# Altium schematic sheet Preamp_protection.SchDoc
size A4
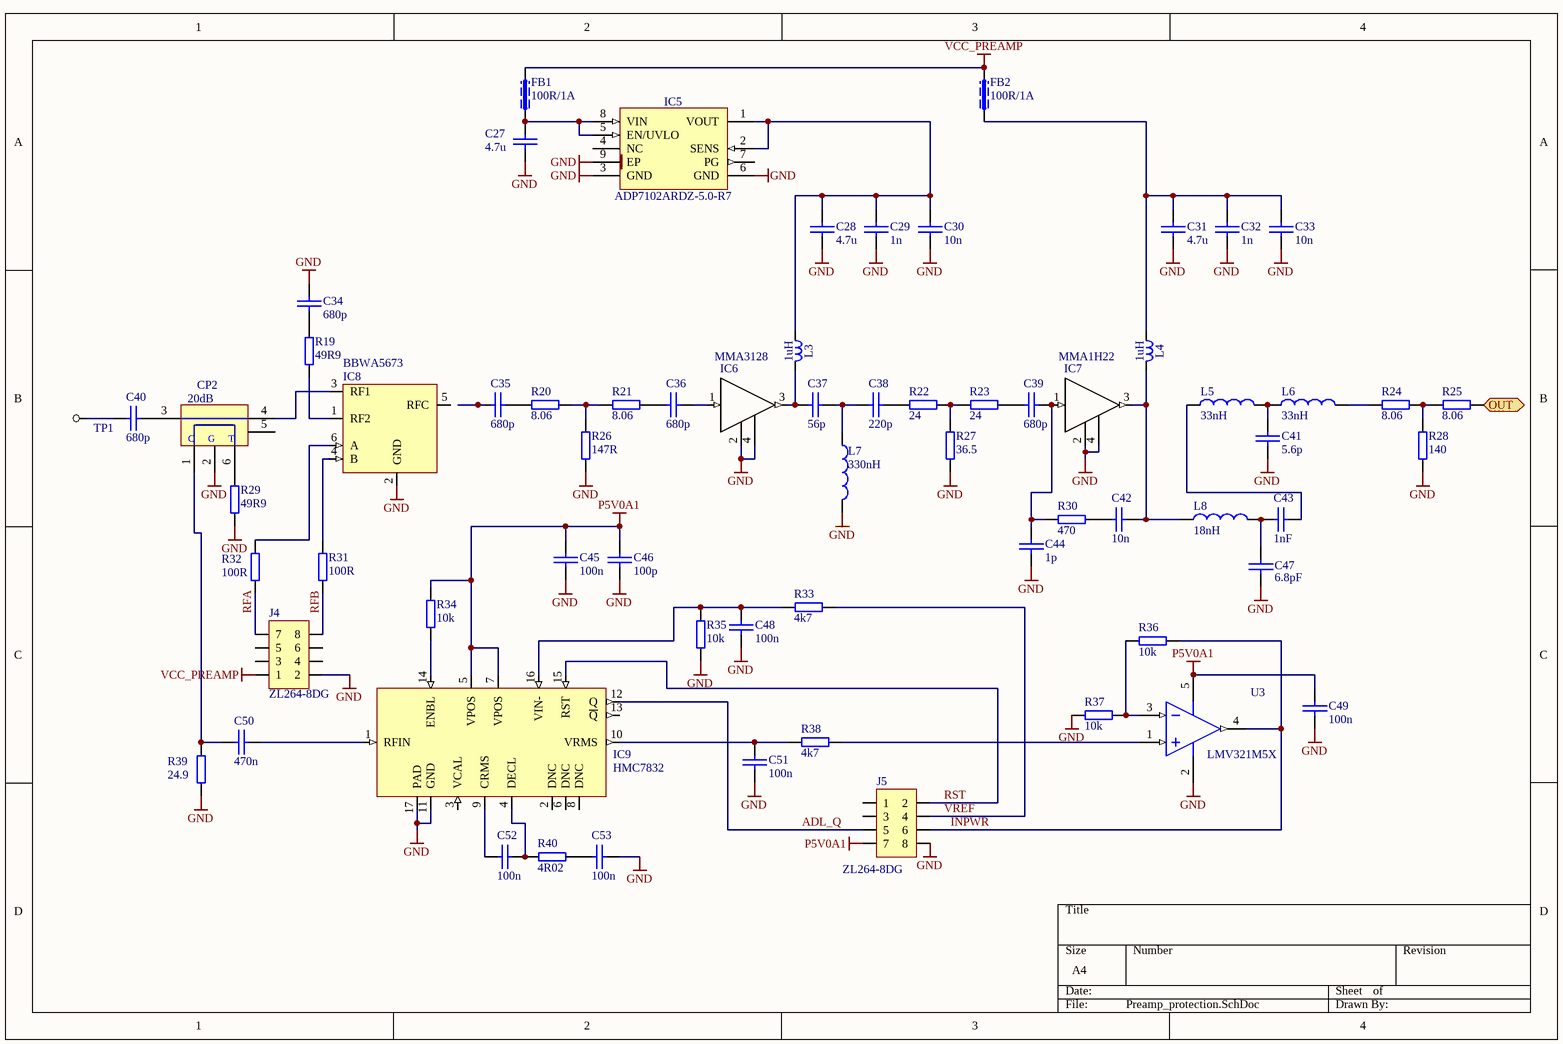
[diagram p0: Preamp_protection.SchDoc]

## Parts
C27  4.7u  [0603C]
C28  4.7u  [0603C]
C29  1n  [0603C]
C30  10n  [0603C]
C31  4.7u  [0603C]
C32  1n  [0603C]
C33  10n  [0603C]
C34  680p  [0603C]
C35  680p  [0603C]
C36  680p  [0603C]
C37  56p  [0603C]
C38  220p  [0603C]
C39  680p  [0603C]
C40  680p  [0603C]
C41  5.6p  [0603C]
C42  10n  [0603C]
C43  1nF  [0603C]
C44  1p  [0603C]
C45  100n  [0603C]
C46  100p  [0603C]
C47  6.8pF  [0603C]
C48  100n  [0603C]
C49  100n  [0603C]
C50  470n  [0603C]
C51  100n  [0603C]
C52  100n  [0603C]
C53  100n  [0603C]
CP2  20dB  [XFMR_MINI-CIRCUITS_AT224]
FB1  100R/1A  [0603L]
FB2  100R/1A  [0603L]
IC5  ADP7102ARDZ-5.0-R7  [SOIC127P600X175-9N-R241X309]
IC6  MMA3128  [SOT89-150P410X170-3N]
IC7  MMA1H22  [SOT89-150P410X170-3N]
IC8  BBWA5673  [SOT95P280X130-6N]
IC9  HMC7832  [QFN50P300X300X80_HS-17N]
J4  ZL264-8DG  [ZL264-8DG]
J5  ZL264-8DG  [ZL264-8DG]
L3  1uH  [INDP2520X18L]
L4  1uH  [INDP2520X18L]
L5  33nH  [0603L]
L6  33nH  [0603L]
L7  330nH  [0603L]
L8  18nH  [0603L]
R19  49R9  [0603R]
R20  8.06  [0603R]
R21  8.06  [0603R]
R22  24  [0603R]
R23  24  [0603R]
R24  8.06  [0603R]
R25  8.06  [0603R]
R26  147R  [0603R]
R27  36.5  [0603R]
R28  140  [0603R]
R29  49R9  [0603R]
R30  470  [0603R]
R31  100R  [0603R]
R32  100R  [0603R]
R33  4k7  [0603R]
R34  10k  [0603R]
R35  10k  [0603R]
R36  10k  [0603R]
R37  10k  [0603R]
R38  4k7  [0603R]
R39  24.9  [0603R]
R40  4R02  [0603R]
TP1  TP  [testpoint]  (value not drawn)
U3  LMV321M5X  [DBV0005A_N]

## Ports
OUT (out)

## Nets
GND: C27.2 C28.2 C29.2 C30.2 C31.2 C32.2 C33.2 C34.2 C41.1 C44.1 C45.2 C46.2 C47.1 C48.1 C49.1 C51.1 C53.2 CP2.2(NC) IC5.3(GND) IC5.6(GND) IC5.9(EP) IC6.2(G) IC6.4(G) IC7.2(G) IC7.4(G) IC8.2(GND) IC9.11(GND) IC9.17(PAD) J4.2 J5.8 L7.2 R26.1 R27.2 R28.2 R29.2 R35.1 R37.2 R39.2 U3.2(V-)
P5V0A1: C45.1 C46.1 C49.2 IC9.5(VPOS) IC9.7(VPOS) J5.7 R34.1 U3.5(V+)
VCC_PREAMP: FB1.2 FB2.2 J4.1
ADL_Q: IC9.12(Q) J5.5
INPWR: J5.6 R36.1 U3.4(OUT)
OUT: R25.1 ; port OUT
RFA: J4.7 R32.2
RFB: J4.8 R31.2
RST: IC9.15(RST) J5.2
VREF: J5.4 R33.1
NetC27_1: C27.1 FB1.1 IC5.5(EN/UVLO) IC5.8(VIN)
NetC28_1: C28.1 C29.1 C30.1 IC5.1(VOUT) IC5.2(SENS) L3.1
NetC31_1: C31.1 C32.1 C33.1 FB2.1 L4.1
NetC34_1: C34.1 R19.1
NetC35_2: C35.2 R20.2
NetC36_1: C36.1 R21.1
NetC36_2: C36.2 IC6.1(IN)
NetC37_1: C37.1 IC6.3(OUT) L3.2
NetC37_2: C37.2 C38.1 L7.1
NetC38_2: C38.2 R22.2
NetC39_1: C39.1 R23.1
NetC39_2: C39.2 C44.2 IC7.1(IN) R30.2
NetC40_1: C40.1 TP1.1
NetC40_2: C40.2 CP2.3(S)
NetC41_2: C41.2 L5.2 L6.1
NetC42_1: C42.1 R30.1
NetC42_2: C42.2 IC7.3(OUT) L4.2 L8.1
NetC43_1: C43.1 L5.1
NetC43_2: C43.2 C47.2 L8.2
NetC48_2: C48.2 IC9.16(VIN-) R33.2 R35.2
NetC50_1: C50.1 CP2.1(SDOT) R39.1
NetC50_2: C50.2 IC9.1(RFIN)
NetC51_2: C51.2 IC9.10(VRMS) R38.2
NetC52_1: C52.1 IC9.9(CRMS)
NetC52_2: C52.2 IC9.4(DECL) R40.1
NetC53_1: C53.1 R40.2
NetCP2_4: CP2.4(P) IC8.3(RF1)
NetCP2_6: CP2.6(PDOT) R29.1
NetIC8_1: IC8.1(RF2) R19.2
NetIC8_4: IC8.4(B) R31.1
NetIC8_6: IC8.6(A) R32.1
NetIC9_14: IC9.14(ENBL) R34.2
NetL6_2: L6.2 R24.2
NetR20_1: R20.1 R21.2 R26.2
NetR22_1: R22.1 R23.2 R27.1
NetR24_1: R24.1 R25.2 R28.1
NetR36_2: R36.2 R37.1 U3.3(IN-)
NetR38_1: R38.1 U3.1(IN+)

Not connected (* = marked no-connect by the designer): C35 1; CP2 5(P); IC5 4(NC) 7(PG); IC8 5(RFC); IC9 2(DNC) 3(VCAL) 6(DNC) 8(DNC) 13(~{Q}); J4 3 4 5 6; J5 1 3

## Notes on the sheet
- (in symbol RF_Coupler_TCD-20-4X) C; G; T

## Library data of the parts
C27 C28 C31 = CAP_SMD_0603: Capacitor SMD; Part: GRM21BR71C475KE51L; Supplier 1: Digi-Key; Supplier Part Number 1: 490-1524-2-ND
C29 C32 = CAP_SMD_0603: Capacitor SMD; Part: GRM1885C1H102JA01D; Supplier 1: Digi-Key; Supplier Part Number 1: 490-1524-2-ND
C30 C33 = CAP_SMD_0603: Capacitor SMD; Part: GRM1885C1H103JA01D; Supplier 1: Digi-Key; Supplier Part Number 1: 490-1524-2-ND
C34-C36 C39 C40 C42 C44 = CAP_SMD_0603: Capacitor SMD; Part: GRM1555C1H681GA01; Supplier 1: Digi-Key; Supplier Part Number 1: 490-1524-2-ND
C37 = CAP_SMD_0603: Capacitor SMD; Part: GRM1885C1H560GA01J; Supplier 1: Digi-Key; Supplier Part Number 1: 490-1524-2-ND
C38 = CAP_SMD_0603: Capacitor SMD; Part: GRM1885C1H221GA01D; Supplier 1: Digi-Key; Supplier Part Number 1: 490-1524-2-ND
C41 C43 C47 = CAP_SMD_0603: Capacitor SMD; Part: GQM1885C2A5R6BB01D; Supplier 1: Digi-Key; Supplier Part Number 1: 490-1524-2-ND
C45 C48 C49 C51-C53 = CAP_SMD_0603: Capacitor SMD; Part: GRM188L81H104KA93D; Supplier 1: Digi-Key
  C45 C48 C51-C53: Supplier Part Number 1: 490-1524-2-ND
C46 = CAP_SMD_0603: Capacitor SMD; Part: C1608NP01H101J080AA; Supplier 1: Digi-Key; Supplier Part Number 1: 490-1524-2-ND
C50 = CAP_SMD_0603: Capacitor SMD; Part: GRM188R71A474KA61D; Supplier 1: Digi-Key; Supplier Part Number 1: 490-1524-2-ND
CP2 = RF_Coupler_TCD-20-4X: 50 Ohms directional coupler; Part Number: XFMR_MINI-CIRCUITS_TCD-20-4X+; Part Description: 50 Ohms 4.5 To 3000MHz RF Transformer; Manufacturer: MINI-CIRCUITS; Manufacturer Part Number: TCD-20-4X+; Component Kind: Standard; Component Type: Standard; Pin Count: 5; Value: 20dB; Status: None; Mounted: Yes; Socket: No; Sense: No; SMD: Yes; ComponentHeight: 3.81mm; HelpURL: \\cern.ch\dfs\Applications\Altium\Datasheets\XFMR_MINI-CIRCUITS_TC1-1-13M+.pdf; Author: GK; CreateDate: 30.11.2011; LatestRevisionDate: 30.11.2011
FB1 FB2 = L_FERRITE_BEAD_0603: ferrite bead 100R@100MHz 1A; Supplier 1: Newark; Supplier Part Number 1: 89R3144
IC5 = ADP7102ARDZ-5.0-R7: 300 mA, Low Noise, CMOS LDO Linear Regulator; Part Description: 5V, 300mA, Low Noise, CMOS LDO Linear Regulator; Manufacturer: ANALOG DEVICES; PressFit: No; Bonding: No; Part Number: ADP7102ARDZ-5.0-R7; Component Kind: Standard; Component Type: Standard; Device: ADP7102ARDZ-5.0-R7; PackageDescription: SOIC 8, Pitch 1.27mm - Body 3.9x4.9mm, (w/thermal tab 2.41mm X 3.098mm), IPC Medium Density; Manufacturer Part Number: ADP7102ARDZ-5.0-R7; Pin Count: 8; Case: SOIC8; Mounted: Yes; Socket: No; SMD: Yes; Sense: No; ComponentHeight: 1.75mm; HelpURL: \\cern.ch\dfs\Applications\Altium\Datasheets\ADP7102ARDZ-5.0-R7.pdf; Author: CERN DEM JLC; CreateDate: 17.03.2014; LatestRevisionDate: 17.03.2014
IC6 = RF_MMG3012N: Broadband High Linearity Amplifier
IC7 = RF_MMG3H21N: Broadband High Linearity Amplifier
IC8 = RF_HMC544AE
IC9 = ADL5904: DC   to 6 GHz  , 45 dB DC  to 6 GHz , 45 dB TruPwr Detector with Envelope Threshold Detection
J4 J5 = CON_2X4 2.54 SMT FEM: 2.54mm pitch connector
L3 L4 = L_1008_100u: 100uH, 60mA, 21R; Part: LQW2UAS1R0J00L; Case: 1008; SMD: Yes; Author: GK
L5 L6 L8 = L_0603_1uH: 1uH, 25mA, 0.6R; Part: LQW18AS33NG00D; Supplier 1: Newark; Supplier Part Number 1: 42M2122
L7 = L_0603_1uH: 1uH, 25mA, 0.6R; Part: LQW18ANR33G00D; Supplier 1: Newark; Supplier Part Number 1: 42M2122
R19 R29 = RES_0603: SMD Resistor; Part: MCT0603PD4999DP500; Supplier 1: Newark; Supplier Part Number 1: 39K0073
R20 R21 R24 R25 = RES_0603: SMD Resistor; Part: CPF0805B8R06E1; Supplier 1: Newark; Supplier Part Number 1: 39K0073
R22 R23 R30 = RES_0603: SMD Resistor; Part: CPF0805B24RE1; Supplier 1: Newark; Supplier Part Number 1: 39K0073
R26 = RES_0603: SMD Resistor; Part: CPF0805B147RE1; Supplier 1: Newark; Supplier Part Number 1: 39K0073
R27 = RES_0603: SMD Resistor; Part: CPF0805B36R5E1; Supplier 1: Newark; Supplier Part Number 1: 39K0073
R28 = RES_0603: SMD Resistor; 140: CPF0805B147RE1; Supplier 1: Newark; Supplier Part Number 1: 39K0073
R31 R32 = RES_0603: SMD Resistor; Part: CRCW0603100RJNEA; Supplier 1: Newark; Supplier Part Number 1: 39K0073
R33 R38 = RES_0603: SMD Resistor; Part: CR0603-FX-4701ELF; Supplier 1: Newark; Supplier Part Number 1: 39K0073
R34-R37 = RES_0603: SMD Resistor; Part: CRCW060310K0FKEA; Supplier 1: Newark; Supplier Part Number 1: 39K0073
R39 = RES_0603: SMD Resistor; Part: CPF0603F24R9C1; Supplier 1: Newark; Supplier Part Number 1: 39K0073
R40 = RES_0603: SMD Resistor; Part: CRCW06034R02FKEA; Supplier 1: Newark; Supplier Part Number 1: 39K0073
TP1 = TP: Testpoint
U3 = CMP-0055-01048-3: General Purpose, Low Voltage, Rail-to-Rail Output Operational Amplifiers, 5-pin SOT-23; Manufacturer: Texas Instruments; PackageTopMarking: A13*XTT; PowerWise: N; Package Reference: DBV0005A; PackageDescription: Molded SOT-23, .115 x .063 x .040 in Body, 5 Lead, .0375 in Pitch; CompType: Amplifiers; RoHS: N; ComponentLink1URL: http://www.ti.com/general/docs/lit/getliterature.tsp?genericPartNumber=LMV321-N&fileType=pdf; PinCount: 5; ComponentLink1Description: Datasheet URL